# Altium schematic sheet FPGA_A.SchDoc: POLYSOME CRYPTO 01
size Tabloid; Revision: V1; SheetNumber: 2; SheetTotal: 8; ProjectName: POLYSOME CRYPTO 01
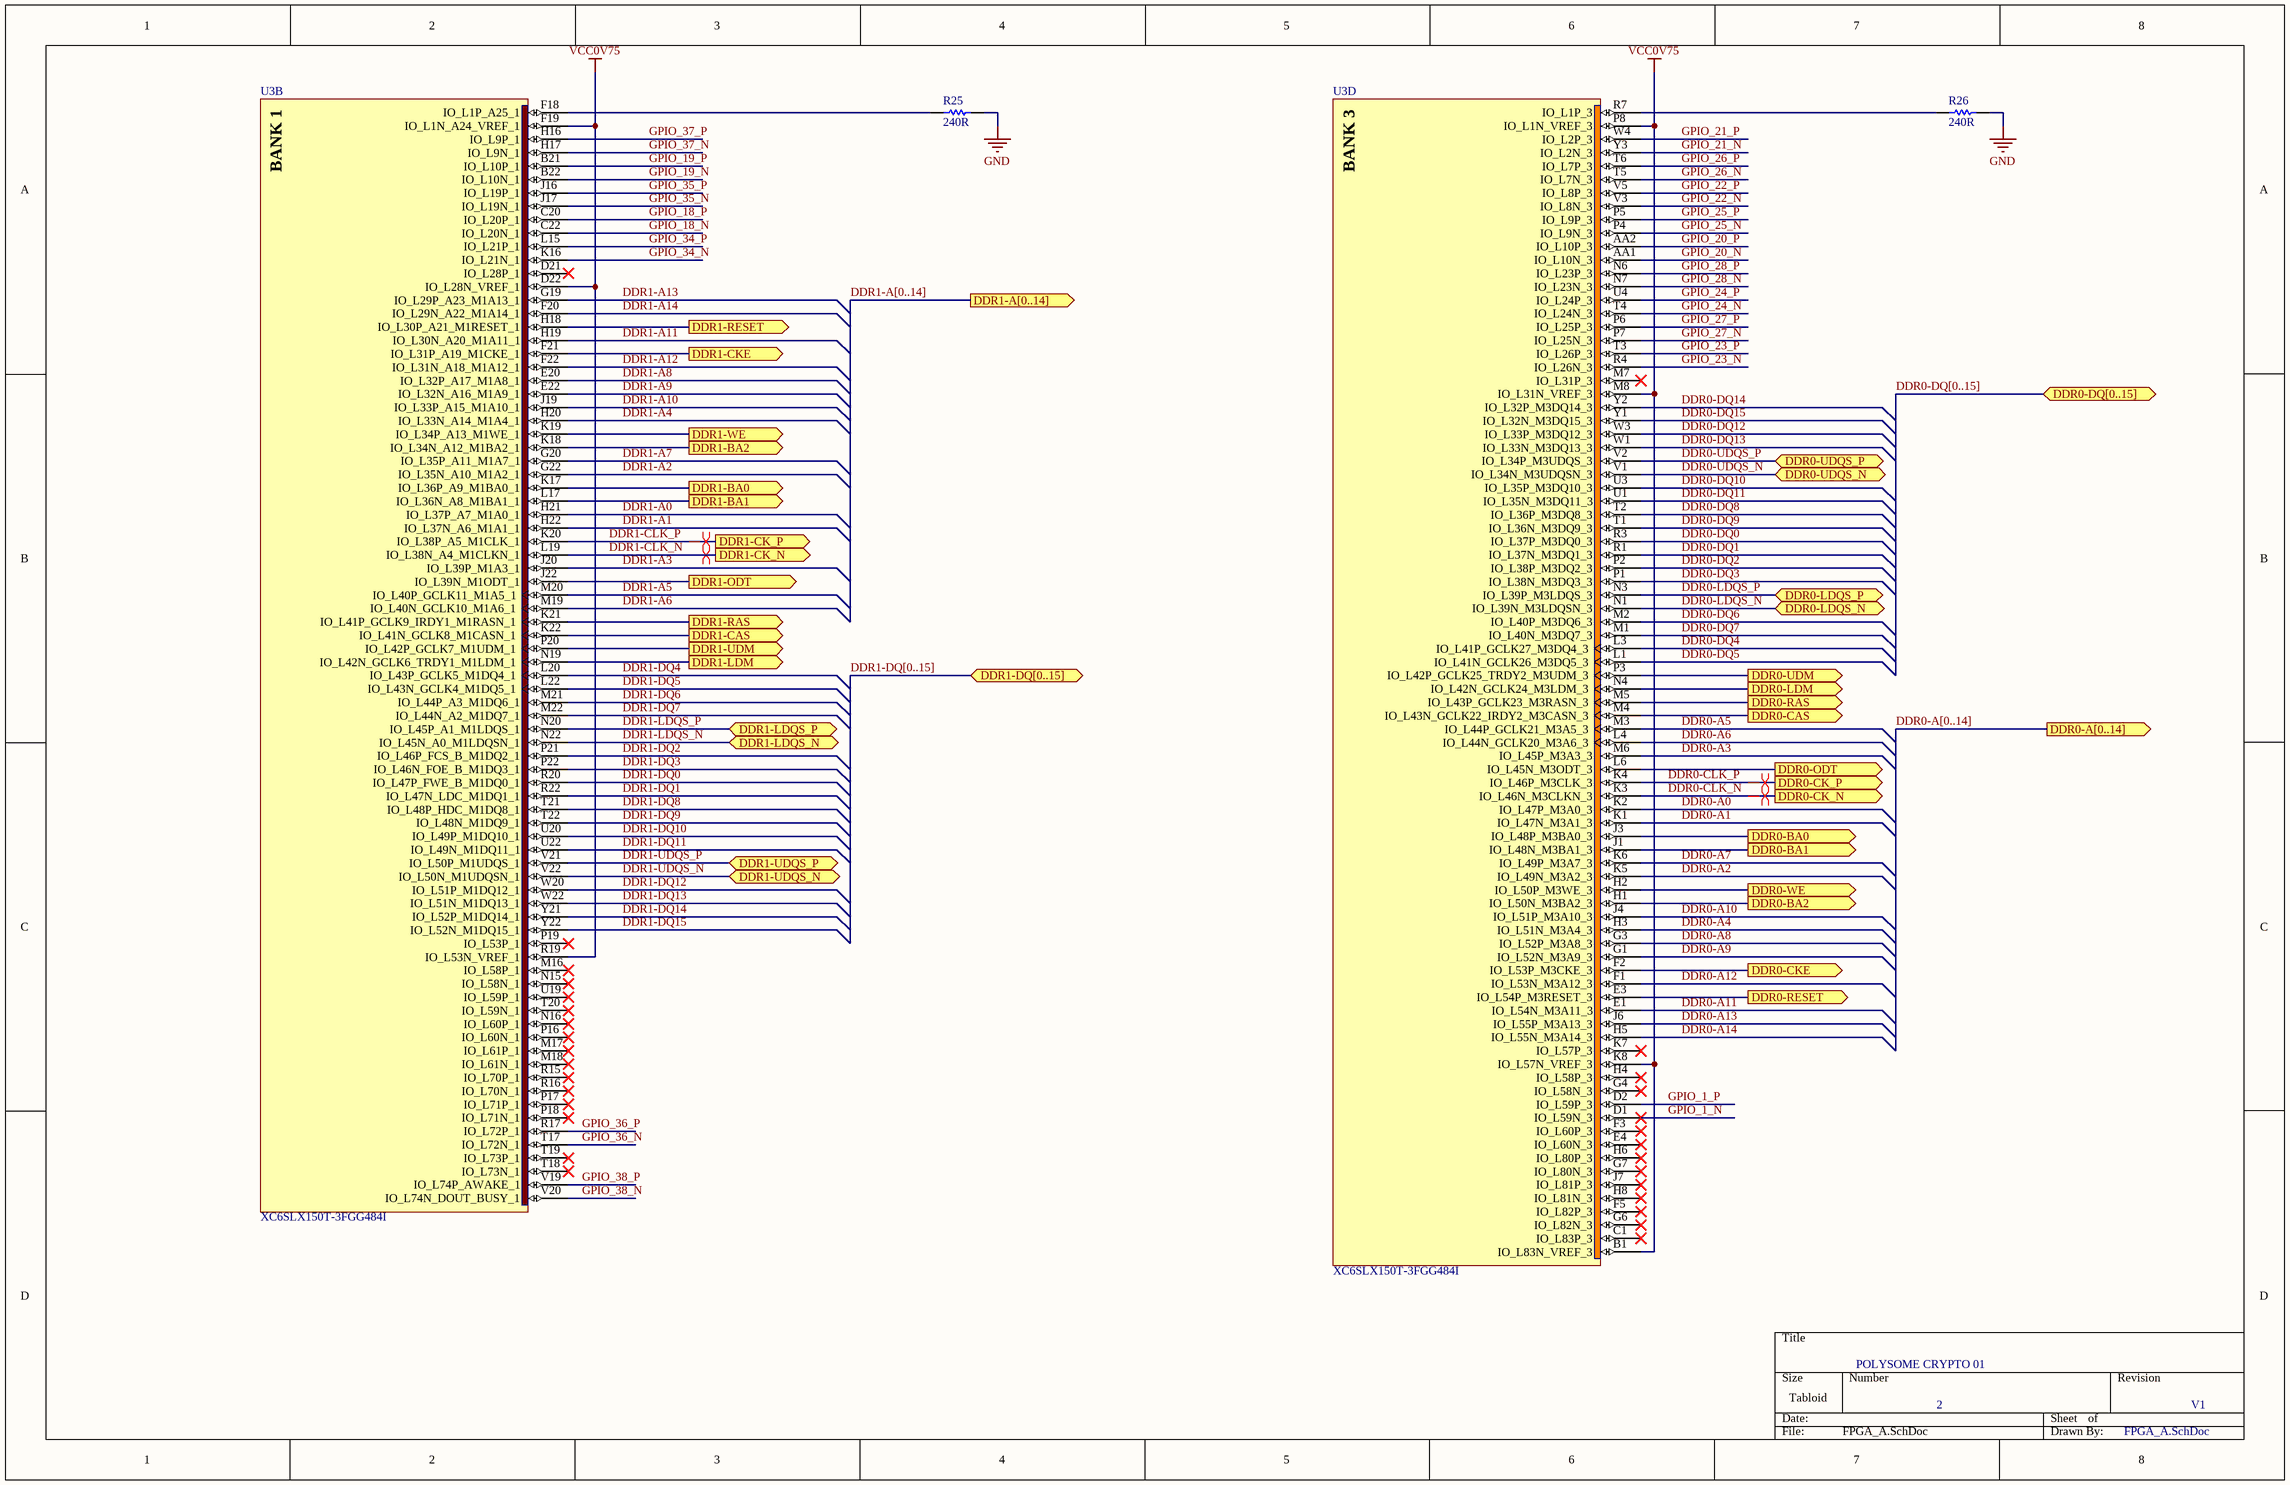
[diagram p0: FPGA_A.SchDoc]

## Parts
R25  value 240R  [0402]  (hidden comment: Res Semi)
R26  value 240R  [0402]  (hidden comment: Res Semi)
U3  XC6SLX150T-3FGG484I  [FGG484]  (parts B,D of 8)

## Ports
DDR0-A[0..14] (out), DDR0-BA0 (out), DDR0-BA1 (out), DDR0-BA2 (out), DDR0-CAS (out), DDR0-CK_N (out), DDR0-CK_P (out), DDR0-CKE (out), DDR0-DQ[0..15] (bidir), DDR0-LDM (out), DDR0-LDQS_N (bidir), DDR0-LDQS_P (bidir), DDR0-ODT (out), DDR0-RAS (out), DDR0-RESET (out), DDR0-UDM (out), DDR0-UDQS_N (bidir), DDR0-UDQS_P (bidir), DDR0-WE (out), DDR1-A[0..14] (out), DDR1-BA0 (out), DDR1-BA1 (out), DDR1-BA2 (out), DDR1-CAS (out), DDR1-CK_N (out), DDR1-CK_P (out), DDR1-CKE (out), DDR1-DQ[0..15] (bidir), DDR1-LDM (out), DDR1-LDQS_N (bidir), DDR1-LDQS_P (bidir), DDR1-ODT (out), DDR1-RAS (out), DDR1-RESET (out), DDR1-UDM (out), DDR1-UDQS_N (bidir), DDR1-UDQS_P (bidir), DDR1-WE (out)

## Nets
GND: R25.2 R26.2
VCC0V75: U3.B1(IO_L83N_VREF_3) U3.D22(IO_L28N_VREF_1) U3.F19(IO_L1N_A24_VREF_1) U3.K8(IO_L57N_VREF_3) U3.M8(IO_L31N_VREF_3) U3.P8(IO_L1N_VREF_3) U3.R19(IO_L53N_VREF_1)
DDR0-A0: U3.K2(IO_L47P_M3A0_3)
DDR0-A1: U3.K1(IO_L47N_M3A1_3)
DDR0-A2: U3.K5(IO_L49N_M3A2_3)
DDR0-A3: U3.M6(IO_L45P_M3A3_3)
DDR0-A4: U3.H3(IO_L51N_M3A4_3)
DDR0-A5: U3.M3(IO_L44P_GCLK21_M3A5_3)
DDR0-A6: U3.L4(IO_L44N_GCLK20_M3A6_3)
DDR0-A7: U3.K6(IO_L49P_M3A7_3)
DDR0-A8: U3.G3(IO_L52P_M3A8_3)
DDR0-A9: U3.G1(IO_L52N_M3A9_3)
DDR0-A10: U3.J4(IO_L51P_M3A10_3)
DDR0-A11: U3.E1(IO_L54N_M3A11_3)
DDR0-A12: U3.F1(IO_L53N_M3A12_3)
DDR0-A13: U3.J6(IO_L55P_M3A13_3)
DDR0-A14: U3.H5(IO_L55N_M3A14_3)
DDR0-BA0: U3.J3(IO_L48P_M3BA0_3) ; port DDR0-BA0
DDR0-BA1: U3.J1(IO_L48N_M3BA1_3) ; port DDR0-BA1
DDR0-BA2: U3.H1(IO_L50N_M3BA2_3) ; port DDR0-BA2
DDR0-CAS: U3.M4(IO_L43N_GCLK22_IRDY2_M3CASN_3) ; port DDR0-CAS
DDR0-CKE: U3.F2(IO_L53P_M3CKE_3) ; port DDR0-CKE
DDR0-CLK_N: U3.K3(IO_L46N_M3CLKN_3) ; port DDR0-CK_N
DDR0-CLK_P: U3.K4(IO_L46P_M3CLK_3) ; port DDR0-CK_P
DDR0-DQ0: U3.R3(IO_L37P_M3DQ0_3)
DDR0-DQ1: U3.R1(IO_L37N_M3DQ1_3)
DDR0-DQ2: U3.P2(IO_L38P_M3DQ2_3)
DDR0-DQ3: U3.P1(IO_L38N_M3DQ3_3)
DDR0-DQ4: U3.L3(IO_L41P_GCLK27_M3DQ4_3)
DDR0-DQ5: U3.L1(IO_L41N_GCLK26_M3DQ5_3)
DDR0-DQ6: U3.M2(IO_L40P_M3DQ6_3)
DDR0-DQ7: U3.M1(IO_L40N_M3DQ7_3)
DDR0-DQ8: U3.T2(IO_L36P_M3DQ8_3)
DDR0-DQ9: U3.T1(IO_L36N_M3DQ9_3)
DDR0-DQ10: U3.U3(IO_L35P_M3DQ10_3)
DDR0-DQ11: U3.U1(IO_L35N_M3DQ11_3)
DDR0-DQ12: U3.W3(IO_L33P_M3DQ12_3)
DDR0-DQ13: U3.W1(IO_L33N_M3DQ13_3)
DDR0-DQ14: U3.Y2(IO_L32P_M3DQ14_3)
DDR0-DQ15: U3.Y1(IO_L32N_M3DQ15_3)
DDR0-LDM: U3.N4(IO_L42N_GCLK24_M3LDM_3) ; port DDR0-LDM
DDR0-LDQS_N: U3.N1(IO_L39N_M3LDQSN_3) ; port DDR0-LDQS_N
DDR0-LDQS_P: U3.N3(IO_L39P_M3LDQS_3) ; port DDR0-LDQS_P
DDR0-ODT: U3.L6(IO_L45N_M3ODT_3) ; port DDR0-ODT
DDR0-RAS: U3.M5(IO_L43P_GCLK23_M3RASN_3) ; port DDR0-RAS
DDR0-RESET: U3.E3(IO_L54P_M3RESET_3) ; port DDR0-RESET
DDR0-UDM: U3.P3(IO_L42P_GCLK25_TRDY2_M3UDM_3) ; port DDR0-UDM
DDR0-UDQS_N: U3.V1(IO_L34N_M3UDQSN_3) ; port DDR0-UDQS_N
DDR0-UDQS_P: U3.V2(IO_L34P_M3UDQS_3) ; port DDR0-UDQS_P
DDR0-WE: U3.H2(IO_L50P_M3WE_3) ; port DDR0-WE
DDR1-A0: U3.H21(IO_L37P_A7_M1A0_1)
DDR1-A1: U3.H22(IO_L37N_A6_M1A1_1)
DDR1-A2: U3.G22(IO_L35N_A10_M1A2_1)
DDR1-A3: U3.J20(IO_L39P_M1A3_1)
DDR1-A4: U3.H20(IO_L33N_A14_M1A4_1)
DDR1-A5: U3.M20(IO_L40P_GCLK11_M1A5_1)
DDR1-A6: U3.M19(IO_L40N_GCLK10_M1A6_1)
DDR1-A7: U3.G20(IO_L35P_A11_M1A7_1)
DDR1-A8: U3.E20(IO_L32P_A17_M1A8_1)
DDR1-A9: U3.E22(IO_L32N_A16_M1A9_1)
DDR1-A10: U3.J19(IO_L33P_A15_M1A10_1)
DDR1-A11: U3.H19(IO_L30N_A20_M1A11_1)
DDR1-A12: U3.F22(IO_L31N_A18_M1A12_1)
DDR1-A13: U3.G19(IO_L29P_A23_M1A13_1)
DDR1-A14: U3.F20(IO_L29N_A22_M1A14_1)
DDR1-BA0: U3.K17(IO_L36P_A9_M1BA0_1) ; port DDR1-BA0
DDR1-BA1: U3.L17(IO_L36N_A8_M1BA1_1) ; port DDR1-BA1
DDR1-BA2: U3.K18(IO_L34N_A12_M1BA2_1) ; port DDR1-BA2
DDR1-CAS: U3.K22(IO_L41N_GCLK8_M1CASN_1) ; port DDR1-CAS
DDR1-CKE: U3.F21(IO_L31P_A19_M1CKE_1) ; port DDR1-CKE
DDR1-CLK_N: U3.L19(IO_L38N_A4_M1CLKN_1) ; port DDR1-CK_N
DDR1-CLK_P: U3.K20(IO_L38P_A5_M1CLK_1) ; port DDR1-CK_P
DDR1-DQ0: U3.R20(IO_L47P_FWE_B_M1DQ0_1)
DDR1-DQ1: U3.R22(IO_L47N_LDC_M1DQ1_1)
DDR1-DQ2: U3.P21(IO_L46P_FCS_B_M1DQ2_1)
DDR1-DQ3: U3.P22(IO_L46N_FOE_B_M1DQ3_1)
DDR1-DQ4: U3.L20(IO_L43P_GCLK5_M1DQ4_1)
DDR1-DQ5: U3.L22(IO_L43N_GCLK4_M1DQ5_1)
DDR1-DQ6: U3.M21(IO_L44P_A3_M1DQ6_1)
DDR1-DQ7: U3.M22(IO_L44N_A2_M1DQ7_1)
DDR1-DQ8: U3.T21(IO_L48P_HDC_M1DQ8_1)
DDR1-DQ9: U3.T22(IO_L48N_M1DQ9_1)
DDR1-DQ10: U3.U20(IO_L49P_M1DQ10_1)
DDR1-DQ11: U3.U22(IO_L49N_M1DQ11_1)
DDR1-DQ12: U3.W20(IO_L51P_M1DQ12_1)
DDR1-DQ13: U3.W22(IO_L51N_M1DQ13_1)
DDR1-DQ14: U3.Y21(IO_L52P_M1DQ14_1)
DDR1-DQ15: U3.Y22(IO_L52N_M1DQ15_1)
DDR1-LDM: U3.N19(IO_L42N_GCLK6_TRDY1_M1LDM_1) ; port DDR1-LDM
DDR1-LDQS_N: U3.N22(IO_L45N_A0_M1LDQSN_1) ; port DDR1-LDQS_N
DDR1-LDQS_P: U3.N20(IO_L45P_A1_M1LDQS_1) ; port DDR1-LDQS_P
DDR1-ODT: U3.J22(IO_L39N_M1ODT_1) ; port DDR1-ODT
DDR1-RAS: U3.K21(IO_L41P_GCLK9_IRDY1_M1RASN_1) ; port DDR1-RAS
DDR1-RESET: U3.H18(IO_L30P_A21_M1RESET_1) ; port DDR1-RESET
DDR1-UDM: U3.P20(IO_L42P_GCLK7_M1UDM_1) ; port DDR1-UDM
DDR1-UDQS_N: U3.V22(IO_L50N_M1UDQSN_1) ; port DDR1-UDQS_N
DDR1-UDQS_P: U3.V21(IO_L50P_M1UDQS_1) ; port DDR1-UDQS_P
DDR1-WE: U3.K19(IO_L34P_A13_M1WE_1) ; port DDR1-WE
GPIO_1_N: U3.D1(IO_L59N_3)
GPIO_1_P: U3.D2(IO_L59P_3)
GPIO_18_N: U3.C22(IO_L20N_1)
GPIO_18_P: U3.C20(IO_L20P_1)
GPIO_19_N: U3.B22(IO_L10N_1)
GPIO_19_P: U3.B21(IO_L10P_1)
GPIO_20_N: U3.AA1(IO_L10N_3)
GPIO_20_P: U3.AA2(IO_L10P_3)
GPIO_21_N: U3.Y3(IO_L2N_3)
GPIO_21_P: U3.W4(IO_L2P_3)
GPIO_22_N: U3.V3(IO_L8N_3)
GPIO_22_P: U3.V5(IO_L8P_3)
GPIO_23_N: U3.R4(IO_L26N_3)
GPIO_23_P: U3.T3(IO_L26P_3)
GPIO_24_N: U3.T4(IO_L24N_3)
GPIO_24_P: U3.U4(IO_L24P_3)
GPIO_25_N: U3.P4(IO_L9N_3)
GPIO_25_P: U3.P5(IO_L9P_3)
GPIO_26_N: U3.T5(IO_L7N_3)
GPIO_26_P: U3.T6(IO_L7P_3)
GPIO_27_N: U3.P7(IO_L25N_3)
GPIO_27_P: U3.P6(IO_L25P_3)
GPIO_28_N: U3.N7(IO_L23N_3)
GPIO_28_P: U3.N6(IO_L23P_3)
GPIO_34_N: U3.K16(IO_L21N_1)
GPIO_34_P: U3.L15(IO_L21P_1)
GPIO_35_N: U3.J17(IO_L19N_1)
GPIO_35_P: U3.J16(IO_L19P_1)
GPIO_36_N: U3.T17(IO_L72N_1)
GPIO_36_P: U3.R17(IO_L72P_1)
GPIO_37_N: U3.H17(IO_L9N_1)
GPIO_37_P: U3.H16(IO_L9P_1)
GPIO_38_N: U3.V20(IO_L74N_DOUT_BUSY_1)
GPIO_38_P: U3.V19(IO_L74P_AWAKE_1)
NetR25_1: R25.1 U3.F18(IO_L1P_A25_1)
NetR26_1: R26.1 U3.R7(IO_L1P_3)

Not connected (* = marked no-connect by the designer): U3 C1(IO_L83P_3)* D21(IO_L28P_1)* E4(IO_L60N_3)* F3(IO_L60P_3)* F5(IO_L82P_3)* G4(IO_L58N_3)* G6(IO_L82N_3)* G7(IO_L80N_3)* H4(IO_L58P_3)* H6(IO_L80P_3)* H8(IO_L81N_3)* J7(IO_L81P_3)* K7(IO_L57P_3)* M7(IO_L31P_3)* M16(IO_L58P_1)* M17(IO_L61P_1)* M18(IO_L61N_1)* N15(IO_L58N_1)* N16(IO_L60P_1)* P16(IO_L60N_1)* P17(IO_L71P_1)* P18(IO_L71N_1)* P19(IO_L53P_1)* R15(IO_L70P_1)* R16(IO_L70N_1)* T18(IO_L73N_1)* T19(IO_L73P_1)* T20(IO_L59N_1)* U19(IO_L59P_1)*

## Buses and harness runs
bus DDR0-A[0..14] = port DDR0-A[0..14]
bus DDR0-DQ[0..15] = port DDR0-DQ[0..15]
bus DDR1-A[0..14] = port DDR1-A[0..14]
bus DDR1-DQ[0..15] = port DDR1-DQ[0..15]

## Layout directives
differential pair; net class DDR1_CLK: DDR1-CLK_N, DDR1-CLK_P
differential pair; net class DDR0_CLK: DDR0-CLK_N, DDR0-CLK_P

## Notes on the sheet
- POLYSOME CRYPTO 01
- (in symbol XC6SLX150T-3FGG484I, part B) BANK 1
- (in symbol XC6SLX150T-3FGG484I, part D) BANK 3

## Library data of the parts
R25 R26 = Res Semi: Semiconductor Resistor; Published: 8-Jun-2000; LatestRevisionDate: 17-Jul-2002; LatestRevisionNote: Re-released for DXP Platform.; PackageReference: AXIAL-0.5; Publisher: Altium Limited; PackageDescription: Axial Device, Thru-Hole; 2 Leads; 0.5 in Pin Spacing
U3 = XC6SLX150T-3FGG484I: Spartan-6 LXT 1.2V FPGA, 296 User I/Os, 484-Ball Fine-Pitch BGA (1.0mm Pitch), Speed Grade 3, Industrial Grade, Pb-Free; Published: 17-Nov-2009; DatasheetVersion: ver1.6, Nov-2010; PackageVersion: ver1.1, Dec-2008; PackageReference: FGG484; Publisher: Altium Limited; PackageDescription: 484-Ball Fine Pitch Ball Grid Array 1.00 mm Pitch (FGG484) - Pb-Free; Supplier 1: Digi-Key; Supplier Part Number 1: XC6SLX150T-3FGG484I-ND; Code_JEDEC: MS-034-AAJ-1; Code_IPC: BGA100P22X22-484; ComponentLink1Description: Manufacturer Link; ComponentLink1URL: http://www.xilinx.com; ComponentLink2Description: Spartan-6 Datasheet; ComponentLink2URL: http://www.xilinx.com/support/documentation/data_sheets/ds160.pdf; ComponentLink3Description: Spartan-6 Documents; ComponentLink3URL: http://www.xilinx.com/support/documentation/spartan-6.htm; ComponentLink4Description: Xilinx.com Home; ComponentLink4URL: http://www.xilinx.com